# EAGLE design CP3_CTRL (EAGLE 9.6.2)
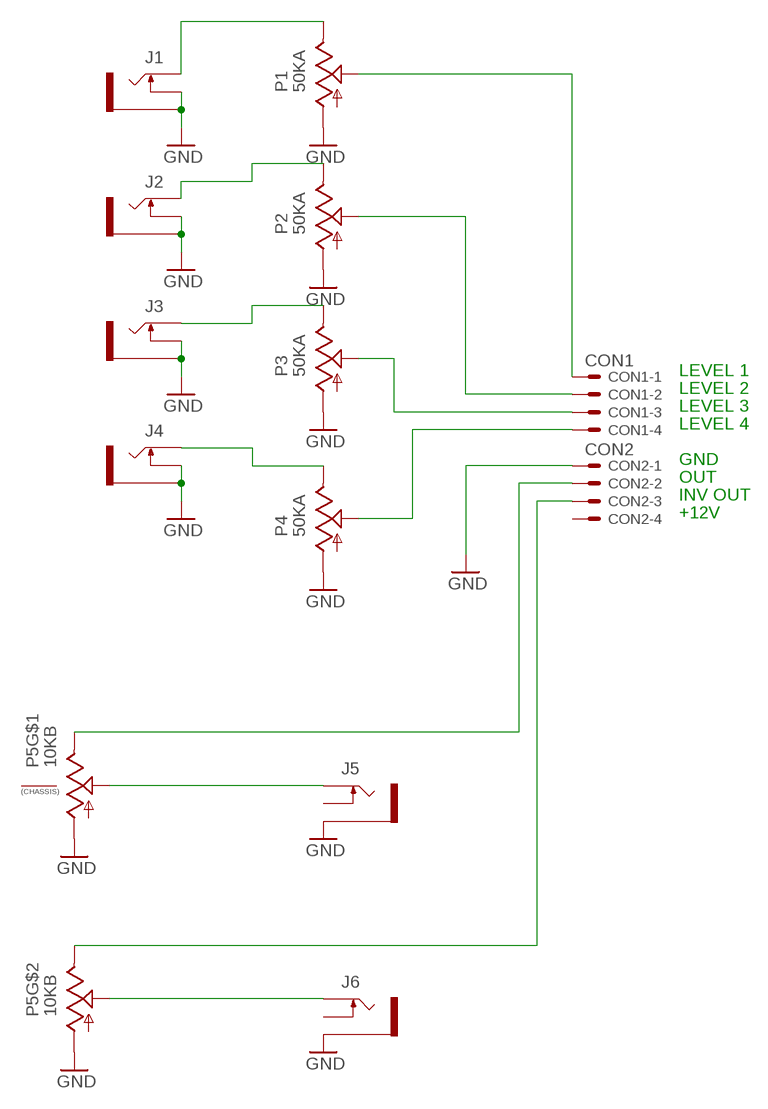
[diagram p0: schematic, sheet 1]

## Parts
CON1  CON1  22-23-2041  [22-23-2041]
CON2  CON2  22-23-2041  [22-23-2041]
J1  WQP518MA  THONKICONNNEW  [WQP-PJ301M-12_JACK]
J2  WQP518MA  THONKICONNNEW  [WQP-PJ301M-12_JACK]
J3  WQP518MA  THONKICONNNEW  [WQP-PJ301M-12_JACK]
J4  WQP518MA  THONKICONNNEW  [WQP-PJ301M-12_JACK]
J5  WQP518MA  THONKICONNNEW  [WQP-PJ301M-12_JACK]
J6  WQP518MA  THONKICONNNEW  [WQP-PJ301M-12_JACK]
P1  50KA  9MM_SNAP-IN_POT_  [9MM_SNAP-IN_POT]
P2  50KA  9MM_SNAP-IN_POT_  [9MM_SNAP-IN_POT]
P3  50KA  9MM_SNAP-IN_POT_  [9MM_SNAP-IN_POT]
P4  50KA  9MM_SNAP-IN_POT_  [9MM_SNAP-IN_POT]
P5  10KB  ALPHA-9MM-DUALPOT  [DUAL_9MM_SNAP-IN_POT]

## Nets
GND: CON2.1 J1.P$2_SWITCH(SWITCH) J1.P$3_SLEEVE(SLEEVE) J2.P$2_SWITCH(SWITCH) J2.P$3_SLEEVE(SLEEVE) J3.P$2_SWITCH(SWITCH) J3.P$3_SLEEVE(SLEEVE) J4.P$2_SWITCH(SWITCH) J4.P$3_SLEEVE(SLEEVE) J5.P$3_SLEEVE(SLEEVE) J6.P$3_SLEEVE(SLEEVE) P1.1(A) P2.1(A) P3.1(A) P4.1(A) P5.1(A) P5.1B(A)
N$1: J1.P$1_TIP(TIP) P1.3(E)
N$2: CON1.1 P1.2(S)
N$3: CON1.2 P2.2(S)
N$4: CON1.3 P3.2(S)
N$5: CON1.4 P4.2(S)
N$7: J2.P$1_TIP(TIP) P2.3(E)
N$8: J3.P$1_TIP(TIP) P3.3(E)
N$9: J4.P$1_TIP(TIP) P4.3(E)
N$10: CON2.2 P5.3(E)
N$11: CON2.3 P5.3B(E)
N$24: J5.P$1_TIP(TIP) P5.2(S)
N$25: J6.P$1_TIP(TIP) P5.2B(S)
Unconnected: CON2.4 J5.P$2_SWITCH(SWITCH) J6.P$2_SWITCH(SWITCH) P5.CHASSIS1 P5.CHASSIS2

## Notes on the sheet
- LEVEL 1
- LEVEL 2
- LEVEL 3
- LEVEL 4
- GND
- OUT
- INV OUT
- +12V

## Library data of the parts
CON1 CON2 = con-molex:22-23-2041: .100" (2.54mm) Center Header - 4 Pin; MF: MOLEX; MPN: 22-23-2041; OC_FARNELL: 1462920; OC_NEWARK: 38C0355
J1-J6 = MusicThingModular:THONKICONN: 3.5mm socket for Eurorack modular synths
P1-P4 = MusicThingModular:9MM_SNAP-IN_POT: 9mm vertical snap-in pot, Alpha / Panasonic style
P5 = MusicThingModular:ALPHA-9MM-DUALPOT: 9mm vertical snap-in pot, Alpha / Panasonic style, with a connection to the metal chassis for grounding

## Board
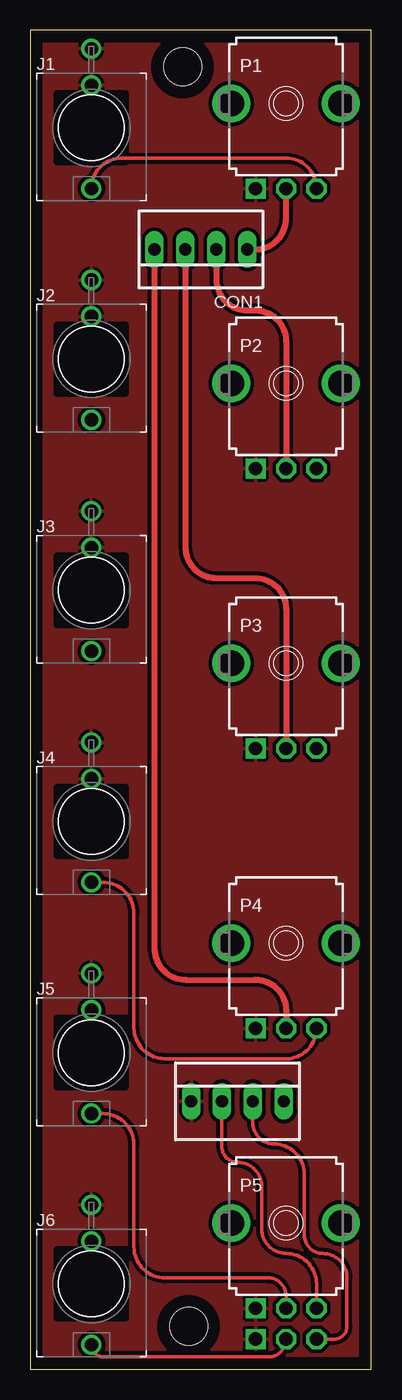
[diagram p1: board, top side]
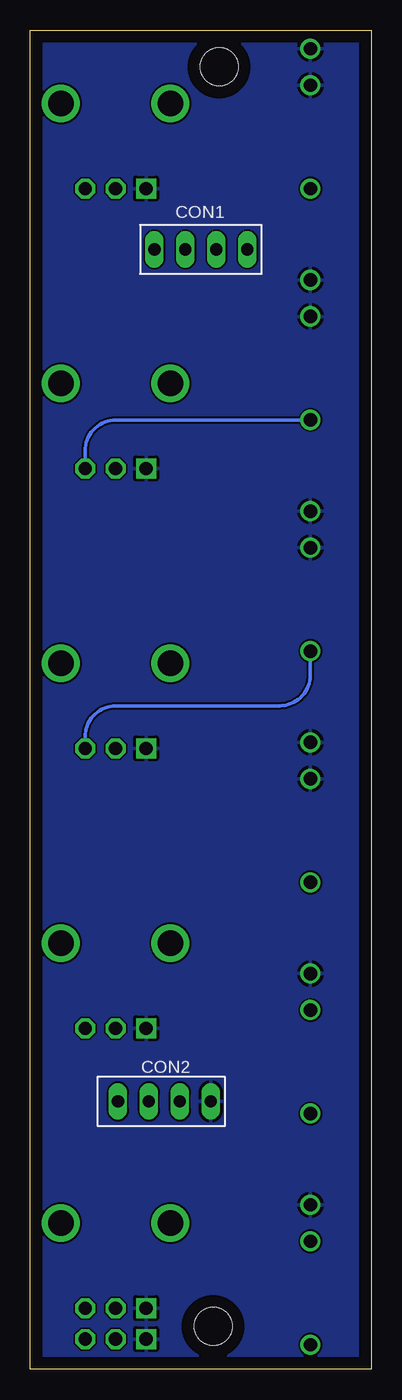
[diagram p2: board, bottom side, seen from below]

Size 28 x 110 mm. Coordinates in mm from the lower left corner, seen from the top.
Outline: 0,0 28,0 28,110 0,110 0,0
Copper layers (1*16): Top 0.035mm / dielectric 1.5mm / Bottom 0.035mm
Design rules "default": minimum track width 6mil, minimum drill 0.35mm, track to track 6mil, track to pad 6mil, pad to pad 6mil, via to via 6mil, smd to smd 6mil, copper to edge 40mil, drill to drill 6mil, minimum pad ring 10mil, minimum via ring 8mil, stop-mask expansion 4mil, vias tented up to drill 0mil, thermal gap 10mil
Holes 3.1 mm at 13,3.5 12.5,107

### Footprints (pad centres in the part's own frame; a part is rotated, then mirrored left to right if it is on the bottom)
22-23-2041 = drill 1 long: 1 -3.81,0; 2 -1.27,0; 3 1.27,0; 4 3.81,0
WQP-PJ301M-12_JACK = drill 1.1: P$1_TIP 0,5; P$2_SWITCH 0,-3.5; P$3_SLEEVE 0,-6.5
9MM_SNAP-IN_POT = drill 1.1 square: 1 -2.5,-7 | drill 1.1 octagon: 2 0,-7; 3 2.5,-7 | drill 2.1 pad 2.54: CHASSIS1 -4.5,0; CHASSIS2 4.5,0
DUAL_9MM_SNAP-IN_POT = drill 1.1 square: 1 -2.5,-7; 1B -2.5,-9.54 | drill 1.1 octagon: 2 0,-7; 2B 0,-9.54; 3 2.5,-7; 3B 2.5,-9.54 | drill 2.1 pad 2.54: CHASSIS1 -4.5,0; CHASSIS2 4.5,0

### Placement (x,y rotation side)
CON1  14,92 180 top
CON2  17,22 0 top
J1  5,102 180 top
J2  5,83 180 top
J3  5,64 180 top
J4  5,45 180 top
J5  5,26 180 top
J6  5,7 180 top
P1  21,104 0 top
P2  21,81 0 top
P3  21,58 0 top
P4  21,35 0 top
P5  21,12 0 top

### Tracks (layer width: path | path; a pad name or v marks a point on that pad's centre or on a via)
GND
  pour Top (isolate 0.305): -0.5,110.5 28.5,110.5 28.5,-0.5 -0.5,-0.5
  pour Bottom: -1,-1 29,-1 29,110.5 -1,110.5
N$1
  Top 0.305: J1.P$1_TIP arc-90 7.5,99.5 21,99.5 arc-90 P1.3
N$2
  Top 0.508: CON1.1 18.46,92 arc90 21,94.54 P1.2
N$3
  Top 0.508: CON1.2 15.27,89.54 arc90 17.81,87 18.46,87 arc-90 21,84.46 P2.2
N$4
  Top 0.508: CON1.3 12.73,67.54 arc90 15.27,65 18.46,65 arc-90 21,62.46 P3.2
N$5
  Top 0.508: CON1.4 10.19,34.54 arc90 12.73,32 18.46,32 arc-90 21,29.46 P4.2
N$7
  Bottom 0.305: P2.3 23.5,75.46 arc90 20.96,78 J2.P$1_TIP
N$8
  Bottom 0.305: P3.3 23.5,51.96 arc90 20.96,54.5 7.54,54.5 arc-90 5,57.04 J3.P$1_TIP
N$9
  Top 0.305: P4.3 arc-90 21,25.5 11.04,25.5 arc-90 8.5,28.04 8.5,37.46 arc90 5.96,40 J4.P$1_TIP
N$10
  Top 0.305: P5.3 23.5,7 arc90 21,9.5 arc-90 19,11.5 19,15 arc90 17,17 arc-90 15.73,18.27 CON2.2
  Top 0.508: P5.3 23.46,5
N$11
  Top 0.305: P5.3B 24.96,2.46 arc90 26,3.5 26,7.5 arc90 24,9.5 arc-90 22.5,11 22.5,16 arc90 20,18.5 arc-90 18.27,20.23 CON2.3
N$24
  Top 0.305: P5.2 21,6 arc90 19.5,7.5 11.04,7.5 arc-90 8.5,10.04 8.5,18.46 arc90 5.96,21 J5.P$1_TIP
N$25
  Top 0.305: P5.2B arc-90 19.54,1 6,1 arc-90 J6.P$1_TIP